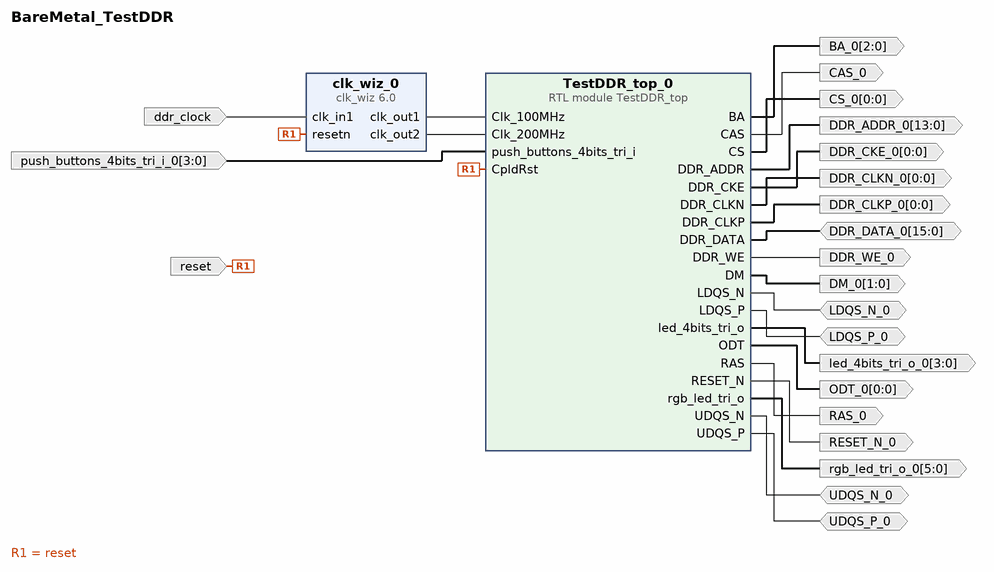
[diagram p0: block diagram of the top level]
# Vivado block design BareMetal_TestDDR, xc7s50csga324-1, Vivado 2022.2
create_bd_design BareMetal_TestDDR

create_bd_port -dir I -type rst reset
set_property -dict {CONFIG.POLARITY ACTIVE_LOW} [get_bd_ports reset]
create_bd_port -dir O -from 3 -to 0 led_4bits_tri_o_0
create_bd_port -dir I -from 3 -to 0 push_buttons_4bits_tri_i_0
create_bd_port -dir O -from 5 -to 0 rgb_led_tri_o_0
create_bd_port -dir I -type clk ddr_clock
set_property -dict {CONFIG.FREQ_HZ 100000000 CONFIG.PHASE 0.0} [get_bd_ports ddr_clock]
create_bd_port -dir O -from 2 -to 0 BA_0
create_bd_port -dir O CAS_0
create_bd_port -dir O -from 0 -to 0 CS_0
create_bd_port -dir O -from 13 -to 0 DDR_ADDR_0
create_bd_port -dir O -from 0 -to 0 DDR_CKE_0
create_bd_port -dir O -from 0 -to 0 DDR_CLKN_0
create_bd_port -dir O -from 0 -to 0 DDR_CLKP_0
create_bd_port -dir IO -from 15 -to 0 DDR_DATA_0
create_bd_port -dir O DDR_WE_0
create_bd_port -dir O -from 1 -to 0 DM_0
create_bd_port -dir IO LDQS_N_0
create_bd_port -dir IO LDQS_P_0
create_bd_port -dir O -from 0 -to 0 ODT_0
create_bd_port -dir O RAS_0
create_bd_port -dir O -type rst RESET_N_0
create_bd_port -dir IO UDQS_N_0
create_bd_port -dir IO UDQS_P_0

create_bd_cell -type module -reference TestDDR_top TestDDR_top_0
create_bd_cell -type ip -vlnv xilinx.com:ip:clk_wiz:6.0 clk_wiz_0
set_property -dict [list \
  CONFIG.CLKOUT1_DRIVES BUFG \
  CONFIG.CLKOUT1_JITTER 130.958 \
  CONFIG.CLKOUT1_PHASE_ERROR 98.575 \
  CONFIG.CLKOUT1_REQUESTED_OUT_FREQ 100.000 \
  CONFIG.CLKOUT2_DRIVES BUFG \
  CONFIG.CLKOUT2_JITTER 114.829 \
  CONFIG.CLKOUT2_PHASE_ERROR 98.575 \
  CONFIG.CLKOUT2_REQUESTED_OUT_FREQ 200.000 \
  CONFIG.CLKOUT2_USED true \
  CONFIG.CLKOUT3_DRIVES BUFG \
  CONFIG.CLKOUT4_DRIVES BUFG \
  CONFIG.CLKOUT5_DRIVES BUFG \
  CONFIG.CLKOUT6_DRIVES BUFG \
  CONFIG.CLKOUT7_DRIVES BUFG \
  CONFIG.CLK_IN1_BOARD_INTERFACE ddr_clock \
  CONFIG.MMCM_BANDWIDTH OPTIMIZED \
  CONFIG.MMCM_CLKFBOUT_MULT_F 10 \
  CONFIG.MMCM_CLKOUT0_DIVIDE_F 10 \
  CONFIG.MMCM_CLKOUT1_DIVIDE 5 \
  CONFIG.MMCM_COMPENSATION ZHOLD \
  CONFIG.NUM_OUT_CLKS 2 \
  CONFIG.PRIMITIVE PLL \
  CONFIG.RESET_BOARD_INTERFACE reset \
  CONFIG.RESET_PORT resetn \
  CONFIG.RESET_TYPE ACTIVE_LOW \
  CONFIG.USE_LOCKED false \
] [get_bd_cells clk_wiz_0]

# ---- connections ----

connect_bd_net [get_bd_ports DDR_DATA_0] [get_bd_pins TestDDR_top_0/DDR_DATA]
connect_bd_net [get_bd_ports LDQS_N_0] [get_bd_pins TestDDR_top_0/LDQS_N]
connect_bd_net [get_bd_ports LDQS_P_0] [get_bd_pins TestDDR_top_0/LDQS_P]
connect_bd_net [get_bd_ports UDQS_N_0] [get_bd_pins TestDDR_top_0/UDQS_N]
connect_bd_net [get_bd_ports UDQS_P_0] [get_bd_pins TestDDR_top_0/UDQS_P]
connect_bd_net [get_bd_pins TestDDR_top_0/BA] [get_bd_ports BA_0]
connect_bd_net [get_bd_pins TestDDR_top_0/CAS] [get_bd_ports CAS_0]
connect_bd_net [get_bd_pins TestDDR_top_0/CS] [get_bd_ports CS_0]
connect_bd_net [get_bd_pins TestDDR_top_0/DDR_ADDR] [get_bd_ports DDR_ADDR_0]
connect_bd_net [get_bd_pins TestDDR_top_0/DDR_CKE] [get_bd_ports DDR_CKE_0]
connect_bd_net [get_bd_pins TestDDR_top_0/DDR_CLKN] [get_bd_ports DDR_CLKN_0]
connect_bd_net [get_bd_pins TestDDR_top_0/DDR_CLKP] [get_bd_ports DDR_CLKP_0]
connect_bd_net [get_bd_pins TestDDR_top_0/DDR_WE] [get_bd_ports DDR_WE_0]
connect_bd_net [get_bd_pins TestDDR_top_0/DM] [get_bd_ports DM_0]
connect_bd_net [get_bd_pins TestDDR_top_0/ODT] [get_bd_ports ODT_0]
connect_bd_net [get_bd_pins TestDDR_top_0/RAS] [get_bd_ports RAS_0]
connect_bd_net [get_bd_pins TestDDR_top_0/RESET_N] [get_bd_ports RESET_N_0]
connect_bd_net [get_bd_pins TestDDR_top_0/led_4bits_tri_o] [get_bd_ports led_4bits_tri_o_0]
connect_bd_net [get_bd_pins TestDDR_top_0/rgb_led_tri_o] [get_bd_ports rgb_led_tri_o_0]
connect_bd_net [get_bd_pins clk_wiz_0/clk_out1] [get_bd_pins TestDDR_top_0/Clk_100MHz]
connect_bd_net [get_bd_pins clk_wiz_0/clk_out2] [get_bd_pins TestDDR_top_0/Clk_200MHz]
connect_bd_net [get_bd_ports ddr_clock] [get_bd_pins clk_wiz_0/clk_in1]
connect_bd_net -net push_buttons_4bits_tri_i_0_1 [get_bd_ports push_buttons_4bits_tri_i_0] [get_bd_pins TestDDR_top_0/push_buttons_4bits_tri_i]
connect_bd_net [get_bd_ports reset] [get_bd_pins TestDDR_top_0/CpldRst] [get_bd_pins clk_wiz_0/resetn]

validate_bd_design
save_bd_design
